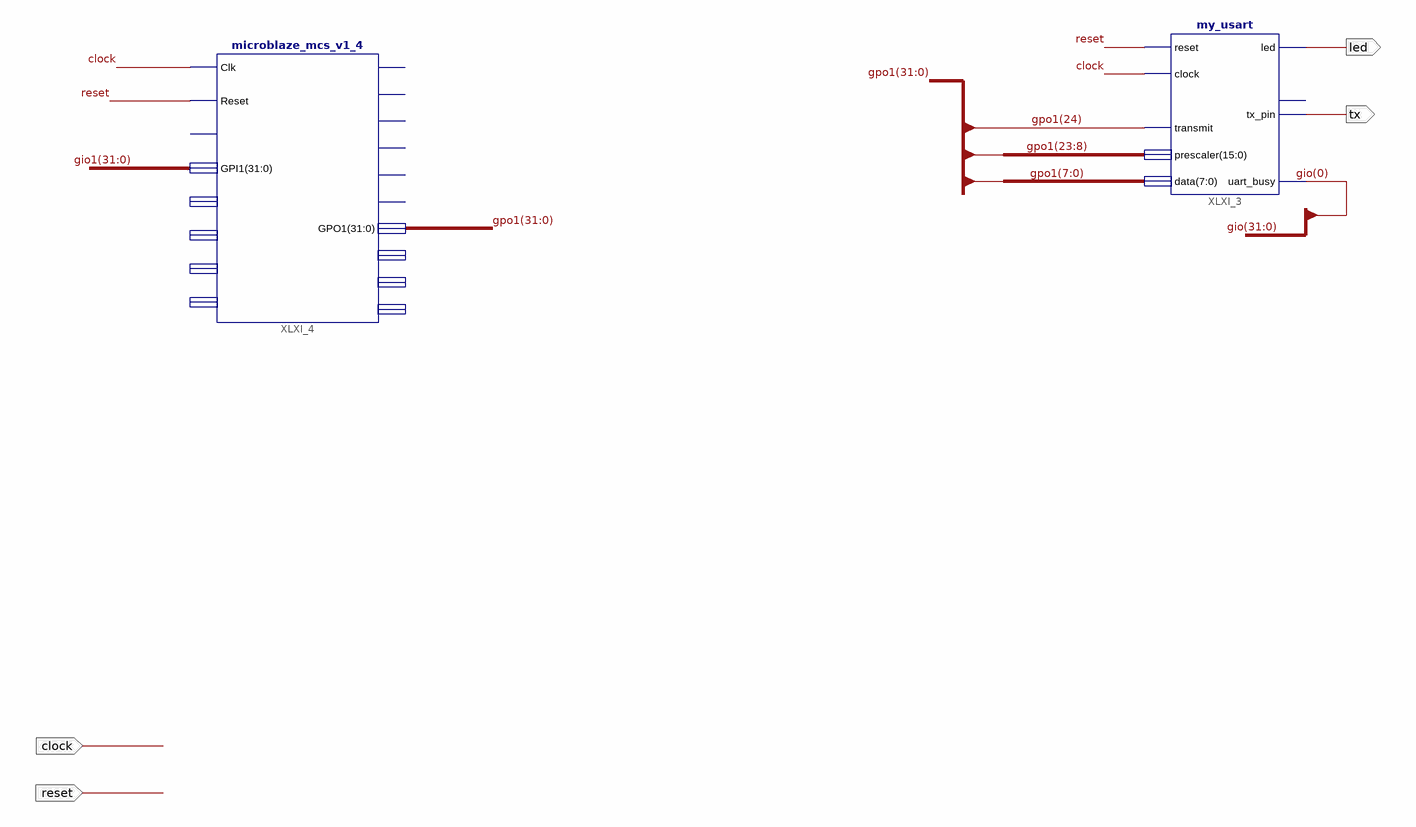
[diagram p0: schematic sheet 1]
// Xilinx ISE schematic schematic_src_1.sch (spartan6) as structural Verilog: 2 symbols, 4 ports
module schematic_src_1 (
  input  reset,
  input  clock,
  output tx,
  output led
);

  wire [0:0] gio;
  wire [31:0] gio1, gpo1;

  my_usart XLXI_3 (
    .reset(reset), .clock(clock), .transmit(gpo1[24]), .prescaler(gpo1[23:8]), .data(gpo1[7:0]), .led(led),
    .tx_pin(tx), .uart_busy(gio[0]));  // open: rx_pin
  microblaze_mcs_v1_4 XLXI_4 (
    .Clk(clock), .Reset(reset), .GPI1(gio1), .GPO1(gpo1));  // open: UART_Rx, GPI2, GPI3, GPI4, INTC_Interrupt, UART_Tx, GPI1_Interrupt, GPI2_Interrupt, GPI3_Interrupt, GPI4_Interrupt, INTC_IRQ, GPO2, GPO3, GPO4
endmodule
